# Altium schematic sheet OM-02P.SchDoc
size A3
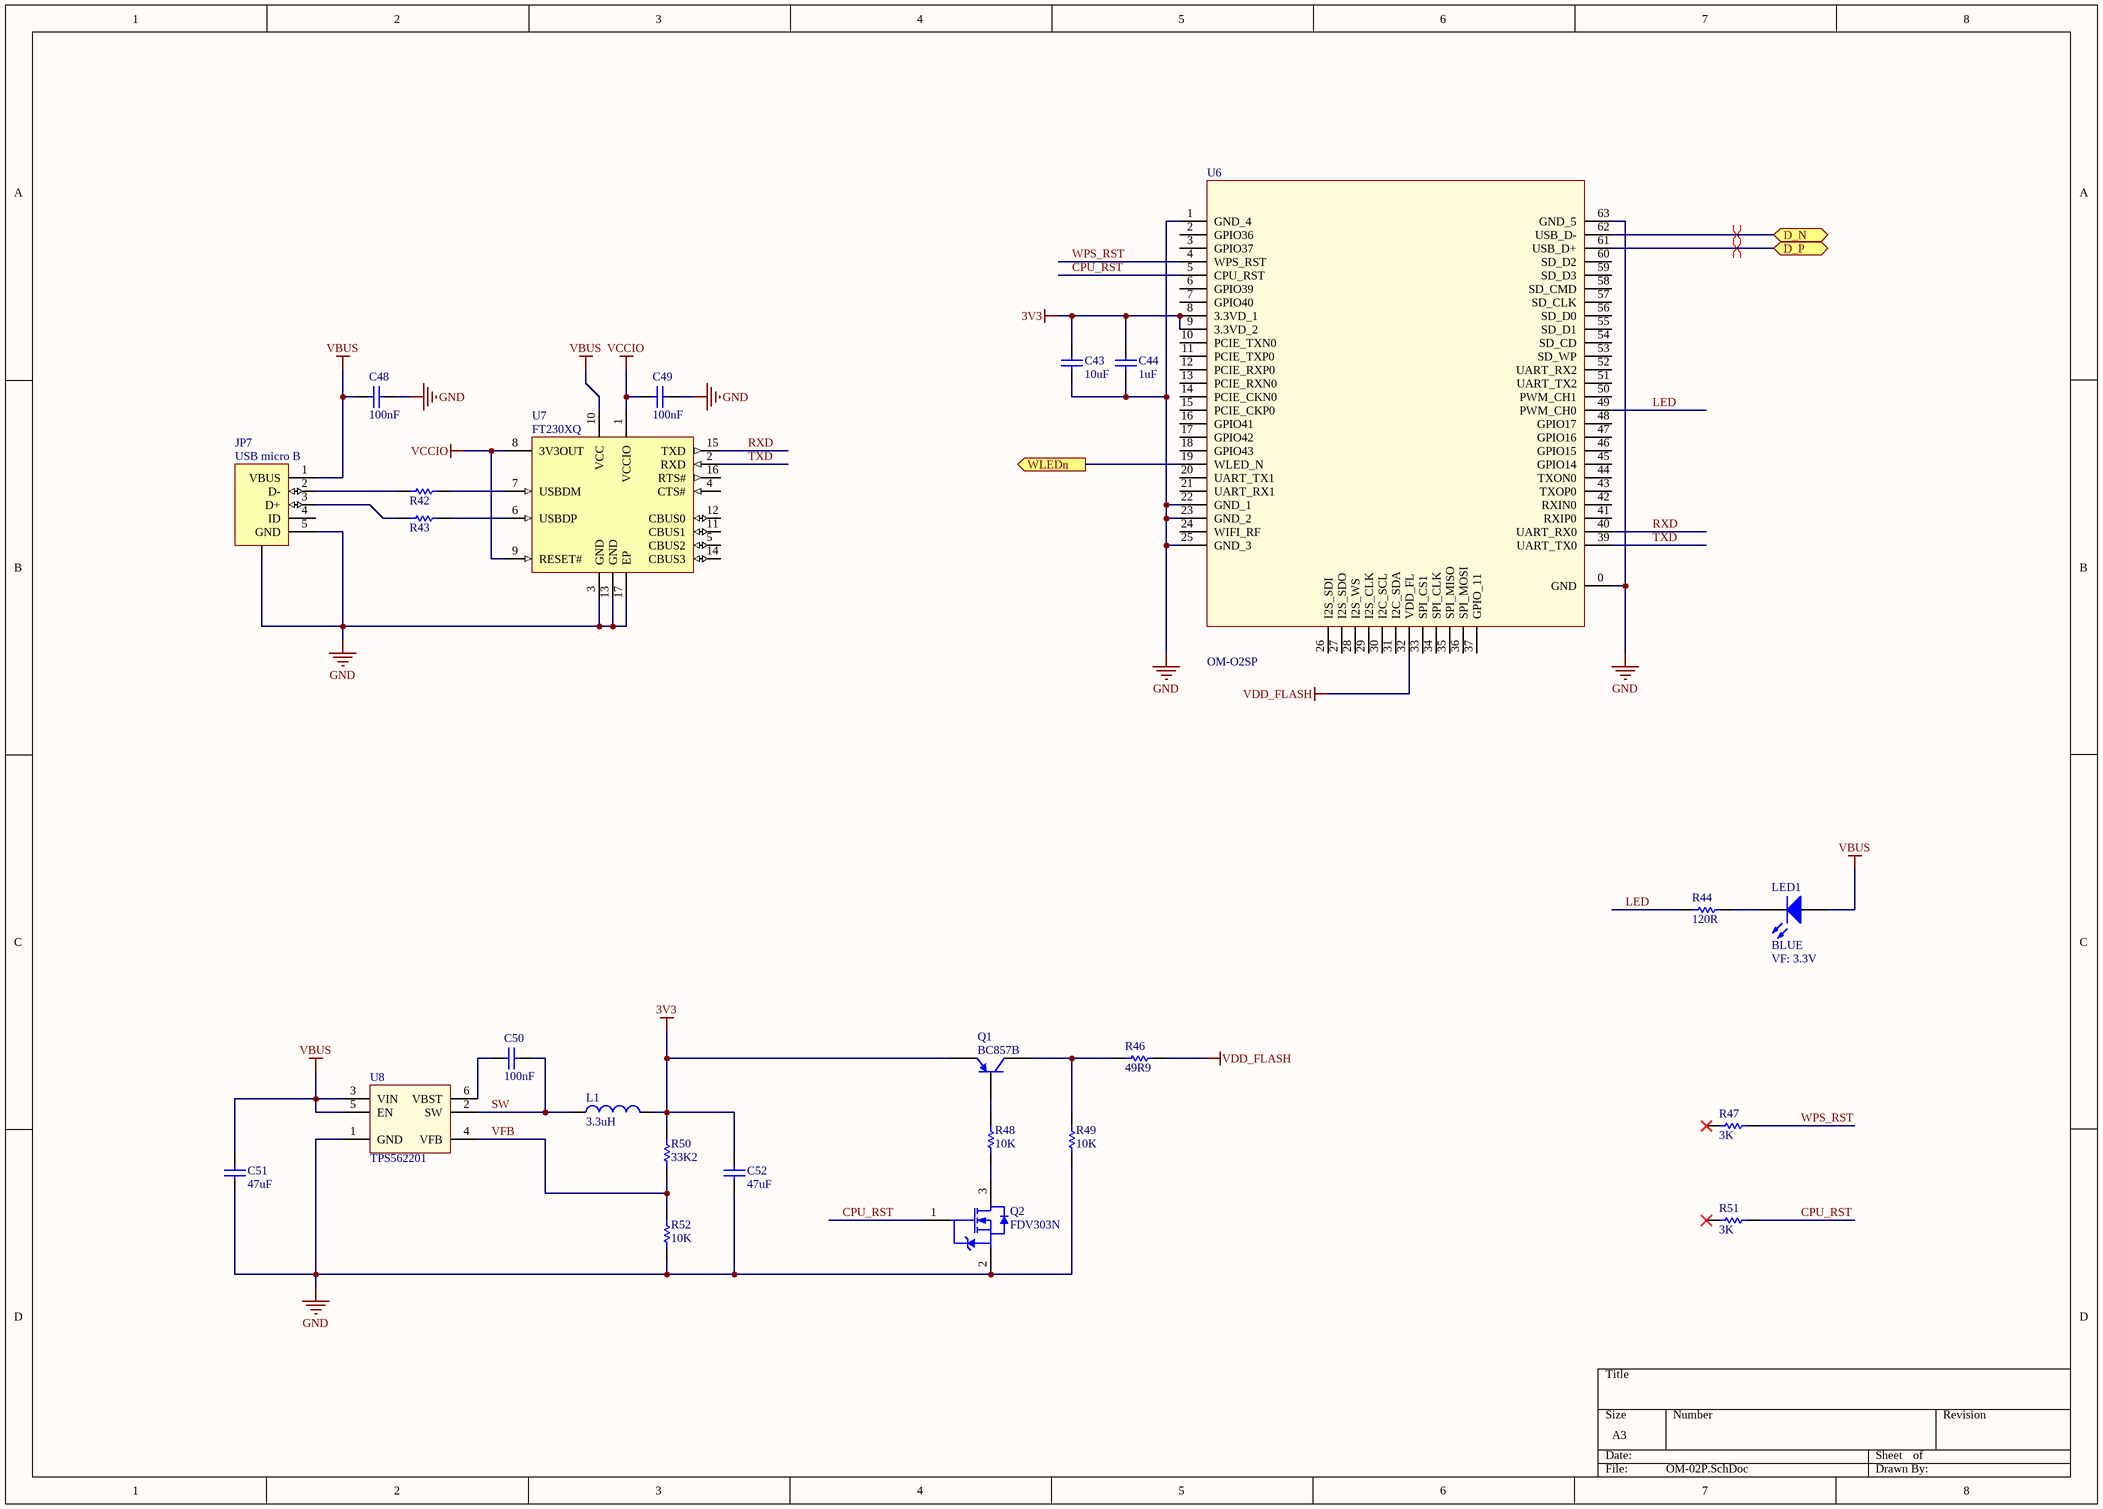
[diagram p0: OM-02P.SchDoc]

## Parts
C43  value 10uF  [CAPC0805(2012)145_N]  (hidden comment: CAP 10uF 16V 0805(2012))
C44  value 1uF  [CAPC0805(2012)145_N]  (hidden comment: CAP 1uF 16V 0805(2012))
C48  value 100nF  [CAPC0805(2012)100_M]  (hidden comment: CAP 100nF 16V 0805(2012))
C49  value 100nF  [CAPC0805(2012)100_M]  (hidden comment: CAP 100nF 16V 0805(2012))
C50  value 100nF  [CAPC0805(2012)100_N]  (hidden comment: CAP 100nF 16V 0805(2012))
C51  value 47uF  [CAPC1210(3225)280_N]  (hidden comment: CAP 47uF 16V 1210(3225))
C52  value 47uF  [CAPC1210(3225)280_N]  (hidden comment: CAP 47uF 16V 1210(3225))
JP7  USB micro B  [CONN_USB_MICRO_B_105017]
L1  value 3.3uH  [CAPC1008(2520)]  (hidden comment: MAMK2520T3R3M)
LED1  BLUE  VF: 3.3V  [LED-KA-4040QBS-D]
Q1  BC857B  [INF-SOT23_M]
Q2  FDV303N  [FAIR-FDV303N-3_V]
R42  RES  [RESC0402(1005)_L]  (value not drawn)
R43  RES  [RESC0402(1005)_L]  (value not drawn)
R44  value 120R  [RESC0805(2012)_N]  (hidden comment: 120R 5% 0805(2012))
R46  value 49R9  [RESC0805(2012)_N]  (hidden comment: 49R9 1% 0805(2012))
R47  value 3K  [RESC0805(2012)_M]  (hidden comment: 3K 5% 0805(2012))
R48  value 10K  [RESC0805(2012)_N]  (hidden comment: 10K 5% 0805(2012))
R49  value 10K  [RESC0805(2012)_N]  (hidden comment: 10K 5% 0805(2012))
R50  value 33K2  [RESC0805(2012)_N]  (hidden comment: 33K2 1% 0805(2012))
R51  value 3K  [RESC0805(2012)_M]  (hidden comment: 3K 5% 0805(2012))
R52  value 10K  [RESC0805(2012)_N]  (hidden comment: 10K 1% 0805(2012))
U6  OM-O2SP  [CPU-OM-O2S]
U7  FT230XQ  [QFN-16_N]
U8  TPS562201  [SOT23-6_L]

## Ports
D_N (bidir), D_P (bidir), WLEDn (out)

## Nets
3V3: C43.2 C44.2 C52.2 L1.2 Q1.2(E) R50.2 U6.8(3.3VD_1) U6.9(3.3VD_2)
GND: C43.1 C44.1 C48.1 C49.1 C51.1 C52.1 JP7.0(CHS) JP7.5(GND) Q2.2(S) R49.2 R52.1 U6.0(GND) U6.1(GND_4) U6.22(GND_1) U6.23(GND_2) U6.25(GND_3) U6.63(GND_5) U7.3(GND) U7.13(GND) U7.17(EP) U8.1(GND)
VBUS: C48.2 C51.2 JP7.1(VBUS) LED1.A U7.10(VCC) U8.3(VIN) U8.5(EN)
VCCIO: C49.2 U7.1(VCCIO) U7.8(3V3OUT) U7.9(RESET#)
VDD_FLASH: R46.2 U6.32(VDD_FL)
CPU_RST: Q2.1(G) R51.1 U6.5(CPU_RST)
D_N: U6.62(USB_D-) ; port D_N
D_P: U6.61(USB_D+) ; port D_P
LED: R44.2 U6.49(PWM_CH0)
RXD: U6.40(UART_RX0) U7.15(TXD)
SW: C50.1 L1.1 U8.2(SW)
TXD: U6.39(UART_TX0) U7.2(RXD)
VFB: R50.1 R52.2 U8.4(VFB)
WLEDn: U6.19(WLED_N) ; port WLEDn
WPS_RST: R47.1 U6.4(WPS_RST)
NetC50_2: C50.2 U8.6(VBST)
NetJP7_2: JP7.2(D-) R42.1
NetJP7_3: JP7.3(D+) R43.1
NetLED1_K: LED1.K R44.1
NetQ1_1: Q1.1(B) R48.1
NetQ1_3: Q1.3(C) R46.1 R49.1
NetQ2_3: Q2.3(D) R48.2
NetR42_2: R42.2 U7.7(USBDM)
NetR43_2: R43.2 U7.6(USBDP)

Not connected (* = marked no-connect by the designer): JP7 4(ID); R47 2*; R51 2*; U6 2(GPIO36) 3(GPIO37) 6(GPIO39) 7(GPIO40) 10(PCIE_TXN0) 11(PCIE_TXP0) 12(PCIE_RXP0) 13(PCIE_RXN0) 14(PCIE_CKN0) 15(PCIE_CKP0) 16(GPIO41) 17(GPIO42) 18(GPIO43) 20(UART_TX1) 21(UART_RX1) 24(WIFI_RF) 26(I2S_SDI) 27(I2S_SDO) 28(I2S_WS) 29(I2S_CLK) 30(I2C_SCL) 31(I2C_SDA) 33(SPI_CS1) 34(SPI_CLK) 35(SPI_MISO) 36(SPI_MOSI) 37(GPIO_11) 41(RXIP0) 42(RXIN0) 43(TXOP0) 44(TXON0) 45(GPIO14) 46(GPIO15) 47(GPIO16) 48(GPIO17) 50(PWM_CH1) 51(UART_TX2) 52(UART_RX2) 53(SD_WP) 54(SD_CD) 55(SD_D1) 56(SD_D0) 57(SD_CLK) 58(SD_CMD) 59(SD_D3) 60(SD_D2); U7 4(CTS#) 5(CBUS2) 11(CBUS1) 12(CBUS0) 14(CBUS3) 16(RTS#)

## Layout directives
differential pair: D_N, D_P

## Library data of the parts
C43 = CMP-1036-04929-1: CAP 10uF 16V ±20% 0805 (2012 Metric) Thickness 1.45mm SMD; Tolerance: Â±20%; Case-EIA: 0805; Case-Metric: 2012; Rated Voltage: 16 V; Technology: SMT; Max Thickness: 1.45 mm
C44 = CMP-1036-04748-1: CAP 1uF 16V ±20% 0805 (2012 Metric) Thickness 1.45mm SMD; Tolerance: Â±20%; Case-Metric: 2012; Case-EIA: 0805; Technology: SMT; Rated Voltage: 16 V; Max Thickness: 1.45 mm
C48-C50 = CMP-1036-04400-1: CAP 100nF 16V ±5% 0805 (2012 Metric) Thickness 1mm SMD; Case-EIA: 0805; Tolerance: Â±5%; Case-Metric: 2012; Max Thickness: 1 mm; Technology: SMT; Rated Voltage: 16 V
C51 C52 = CMP-1038-02296-1: CAP 47uF 16V ±20% 1210 (3225 Metric) Thickness 2.8mm SMD; MPN: C1210C476M4PACTU; Case-EIA: 1210; Case-Metric: 3225; Tolerance: Â±20%; Technology: SMT; Max Thickness: 2.8 mm; Rated Voltage: 16 V
JP7 = CONN_USB_MICRO_B_105017: USB - micro B USB 2.0 Receptacle Connector 5 Position Surface Mount, Right Angle; MPN: 1050170001; Farnell: 2293836; DigiKey: WM1399TR-ND
L1 = L-MAMK2520T3R3M: 3.3µH Shielded Wirewound Inductor 1.7A 156 mOhm Max 1008 (2520 Metric); DigiKey: 587-3227-2-ND; MPN: MAMK2520T3R3M
LED1 = LED-BLUE-KA-4040QBS-D: LED 0805; VALUE: BLUE; MPN: KA-4040QBS-D; Farnell: 2079906
Q1 = CMP-1177-00036-1: PNP Silicon AF Transistor, 45 V VCEO, 100 mA IC, SOT23, Reel, Green; Manufacturer: Infineon; Ptot (max): 330Â mW; fT (typ): 250Â MHz; VCBO (max): 50Â V; ICM (max): 200Â mA; Green: TRUE; VCEO (max): 45Â V; VEBO (max): 5Â V; ICBO (max): 15Â nA; IC (max): 100Â mA; ComponentLink2Description: Datasheet; PartNumber: BC857B; PackageReference: SOT23; ComponentLink1URL: http://www.infineon.com/; IBM (max): 200Â mA; PackageDescription: 3-Pin Small Outline Transistor Package, 1.3 x 2.9 mm Body, 0.95 mm Pitch; ComponentLink3URL: http://www.infineon.com/dgdl/SOT23-Package_Overview.pdf?folderId=db3a30431936bc4b0119532290053c66&fileId=db3a30431936bc4b0119533468123c85; ComponentLink3Description: Package Specification; Mounting Technology: Surface Mount; ComponentLink1Description: Manufacturer URL; PackageVersion: Apr-08; Polarity: PNP; ComponentLink2URL: http://www.infineon.com/dgdl/bc857series_bc858series_bc859series_bc860series.pdf?folderId=db3a304314dca389011541d30fa21656&fileId=db3a304314dca389011541da0e3a1661; Packing: Reel
Q2 = CMP-2000-05111-1: N-Channel MOSFET Transistor, 8 V VGSS, 25 V VDSS, 0.68 A, -55 to 150 degC, 3-Pin SOT23, RoHS, Tape and Reel; Manufacturer: Fairchild; Typical Turn-On Delay Time: 3ns; Channel Mode: Enhancement; RDS-on: 450@4.5VmOhm; Maximum Continuous Drain Current: 0.68A; Maximum Drain Source Voltage: 25V; Rad Hard: No; Typical Fall Time: 13ns; Channel Type: N; Typical Turn-Off Delay Time: 17ns; Maximum Gate Source Voltage: 8V; Typical Rise Time: 8.5ns; Mounting: SurfaceMount; Packaging: Tape&Reel; Manufacturer URL: https://www.fairchildsemi.com/; Datasheet URL: https://datasheet.ciiva.com/22681/1845307-22681736.pdf; Package: 3SOT-23; Category: MOSFET; Operating Temperature: -55to150degC; Datasheet Version: Rev. D2, 07/2014
R42 R43 = RES: Generic resistor; Value: 27R
R44 = CMP-1013-00052-1: 120R 0.125W 5% 0805 (2012 Metric)  SMD; Case-Metric: 2012; Case-EIA: 0805; Tolerance: 5 %; Technology: SMT; Power: 0.125 W
R46 = CMP-1013-00363-1: 49R9 0.125W 1% 0805 (2012 Metric)  SMD; Case-Metric: 2012; Case-EIA: 0805; Power: 0.125 W; Tolerance: 1 %; Technology: SMT
R47 R51 = CMP-1013-00085-1: 3K 0.125W 5% 0805 (2012 Metric)  SMD; Case-Metric: 2012; Case-EIA: 0805; Power: 0.125 W; Tolerance: 5 %; Technology: SMT
R48 R49 = CMP-1013-00098-1: 10K 0.125W 5% 0805 (2012 Metric)  SMD; Case-EIA: 0805; Case-Metric: 2012; Power: 0.125 W; Technology: SMT; Tolerance: 5 %
R50 = CMP-1013-00681-1: 33K2 0.125W 1% 0805 (2012 Metric)  SMD; Case-Metric: 2012; Case-EIA: 0805; Technology: SMT; Tolerance: 1 %; Power: 0.125 W
R52 = CMP-1013-00623-1: 10K 0.125W 1% 0805 (2012 Metric)  SMD; Case-Metric: 2012; Case-EIA: 0805; Tolerance: 1 %; Power: 0.125 W; Technology: SMT
U6 = CPU-OM-O2SP: Onion Omega2S
U7 = IC-COM-USB-FT230XQ-SQ17
U8 = IC-PMIC-TPS562201: Buck Switching Regulator IC Positive Adjustable 0.768V 1 Output 2A SOT-23-6 Thin, TSOT-23-6; MPN: TPS562201DDCT